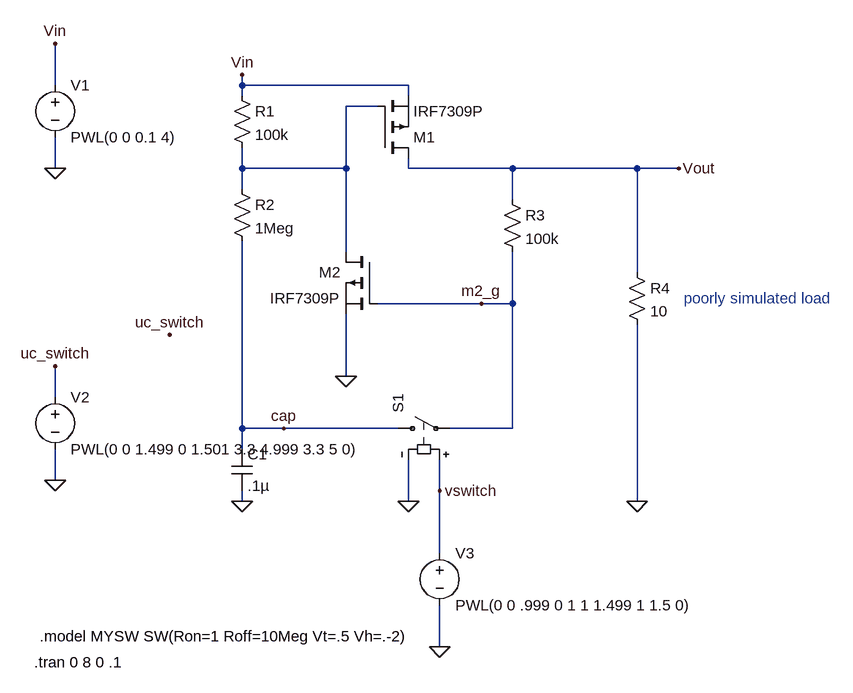
[diagram p0: schematic softpower_1.asc]
softpower_1.asc, the LTspice schematic file:
Version 4
SHEET 1 880 856
WIRE -448 -48 -448 -112
WIRE -160 -48 -160 -64
WIRE 96 -48 -160 -48
WIRE -160 -32 -160 -48
WIRE 96 -32 96 -48
WIRE 48 -16 0 -16
WIRE -448 80 -448 32
WIRE -160 80 -160 48
WIRE 0 80 0 -16
WIRE 0 80 -160 80
WIRE 96 80 96 64
WIRE 256 80 96 80
WIRE 448 80 256 80
WIRE 512 80 448 80
WIRE -160 112 -160 80
WIRE 256 128 256 80
WIRE 0 208 0 80
WIRE 448 240 448 80
WIRE 208 288 48 288
WIRE 256 288 256 208
WIRE 256 288 208 288
WIRE 0 400 0 304
WIRE -448 432 -448 384
WIRE -160 480 -160 192
WIRE -96 480 -160 480
WIRE 80 480 -96 480
WIRE 256 480 256 288
WIRE 256 480 160 480
WIRE -160 512 -160 480
WIRE -448 560 -448 512
WIRE 144 576 144 528
WIRE -160 592 -160 576
WIRE 96 592 96 528
WIRE 448 592 448 320
WIRE 144 672 144 576
WIRE 144 816 144 752
FLAG -160 592 0
FLAG 0 400 0
FLAG 448 592 0
FLAG -160 -64 Vin
FLAG 512 80 Vout
FLAG -272 336 uc_switch
FLAG -448 560 0
FLAG -448 80 0
FLAG -448 -112 Vin
FLAG -448 384 uc_switch
FLAG 144 816 0
FLAG 96 592 0
FLAG 144 576 vswitch
FLAG 208 288 m2_g
FLAG -96 480 cap
SYMBOL pmos 48 64 M180
SYMATTR InstName M1
SYMATTR Value IRF7309P
SYMBOL pmos 48 208 M0
SYMATTR InstName M2
SYMATTR Value IRF7309P
SYMBOL res -176 -48 R0
SYMATTR InstName R1
SYMATTR Value 100k
SYMBOL res -176 96 R0
SYMATTR InstName R2
SYMATTR Value 1Meg
SYMBOL cap -176 512 R0
SYMATTR InstName C1
SYMATTR Value .1µ
SYMBOL res 240 112 R0
SYMATTR InstName R3
SYMATTR Value 100k
SYMBOL res 432 224 R0
SYMATTR InstName R4
SYMATTR Value 10
SYMBOL sw 64 480 R270
SYMATTR InstName S1
SYMATTR Value ""
SYMATTR SpiceModel MYSW
SYMBOL voltage -448 -64 R0
WINDOW 123 0 0 Left 2
WINDOW 39 0 0 Left 2
SYMATTR InstName V1
SYMATTR Value PWL(0 0 0.1 4)
SYMBOL voltage -448 416 R0
WINDOW 123 0 0 Left 2
WINDOW 39 0 0 Left 2
SYMATTR InstName V2
SYMATTR Value PWL(0 0 1.499 0 1.501 3.3 4.999 3.3 5 0)
SYMBOL voltage 144 656 R0
WINDOW 123 0 0 Left 2
WINDOW 39 0 0 Left 2
SYMATTR InstName V3
SYMATTR Value PWL(0 0 .999 0 1 1 1.499 1 1.5 0)
TEXT 520 280 Left 2 ;poorly simulated load
TEXT -480 840 Left 2 !.tran 0 8 0 .1
TEXT -472 800 Left 2 !.model MYSW SW(Ron=1 Roff=10Meg Vt=.5 Vh=.-2)

The netlist it stands for:
* softpower_1.asc
M1 Vout N001 Vin Vin IRF7309P
M2 N001 m2_g 0 0 IRF7309P
R1 Vin N001 100k
R2 N001 cap 1Meg
C1 cap 0 .1µ
R3 Vout m2_g 100k
R4 Vout 0 10
S1 cap m2_g vswitch 0 MYSW
V1 Vin 0 PWL(0 0 0.1 4)
V2 uc_switch 0 PWL(0 0 1.499 0 1.501 3.3 4.999 3.3 5 0)
V3 vswitch 0 PWL(0 0 .999 0 1 1 1.499 1 1.5 0)
.model NMOS NMOS
.model PMOS PMOS
.lib standard.mos
* poorly simulated load
.tran 0 8 0 .1
.model MYSW SW(Ron=1 Roff=10Meg Vt=.5 Vh=.-2)
.backanno
.end